# Altium project Boards for simple simulation.PrjPcb
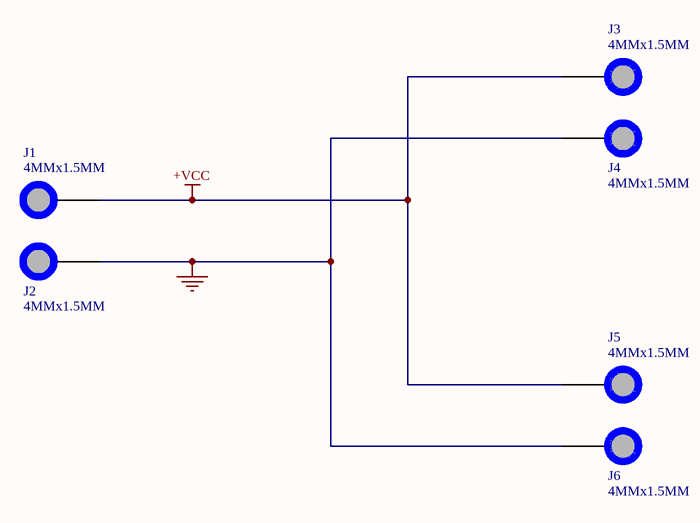
[diagram p0: Schematic.SchDoc]
1 sheet, 6 parts. Net scope: global (net labels, ports and power ports of the same name join across sheets).
Board files: PCB01.PcbDoc, PCB02.PcbDoc, PCB03.PcbDoc, PCB04.PcbDoc, PCB05.PcbDoc, PCB06.PcbDoc, PCB07.PcbDoc, PCB08.PcbDoc

## Sheet Schematic.SchDoc
size A

### Parts
J1  4MMx1.5MM  [PAD_WITH_HOLE_4MMx1MM5]
J2  4MMx1.5MM  [PAD_WITH_HOLE_4MMx1MM5]
J3  4MMx1.5MM  [PAD_WITH_HOLE_4MMx1MM5]
J4  4MMx1.5MM  [PAD_WITH_HOLE_4MMx1MM5]
J5  4MMx1.5MM  [PAD_WITH_HOLE_4MMx1MM5]
J6  4MMx1.5MM  [PAD_WITH_HOLE_4MMx1MM5]

### Nets
+VCC: J1.1 J3.1 J5.1
GND: J2.1 J4.1 J6.1

### Library data of the parts
J1-J6 = PAD_WITH_HOLE_4MMx1MM5: Pad with a hole 4mm x 1.5mm